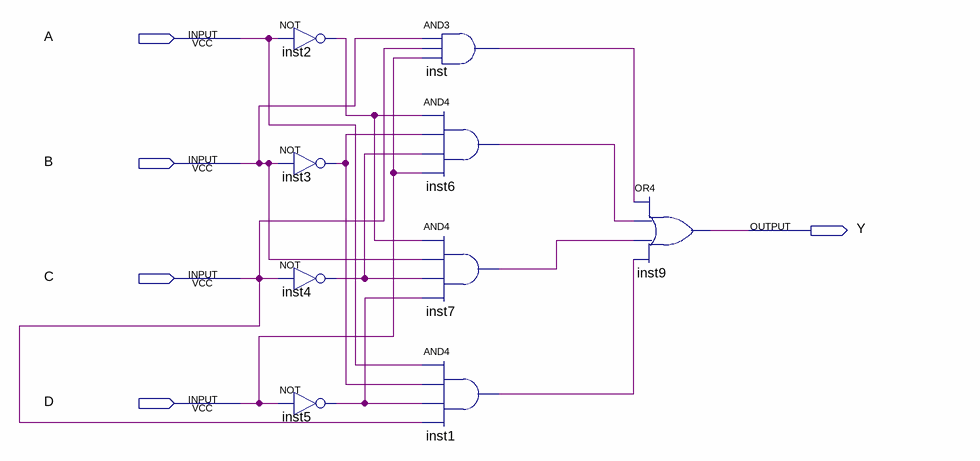
[diagram p0: schematic sheet]
// Quartus schematic circuit3.bdf as structural Verilog: 9 symbols, 5 pins
module circuit3 (
  input  A,
  input  B,
  input  C,
  input  D,
  output Y
);

  wire inst1_out, inst2_out, inst3_out, inst4_out, inst5_out, inst6_out, inst7_out, inst_out;

  not inst2 (inst2_out, A);
  not inst3 (inst3_out, B);
  not inst4 (inst4_out, C);
  not inst5 (inst5_out, D);
  and inst (inst_out, B, C, D);
  and inst6 (inst6_out, inst2_out, inst3_out, inst4_out, D);
  and inst7 (inst7_out, inst2_out, B, inst4_out, inst5_out);
  and inst1 (inst1_out, A, inst3_out, inst5_out, C);
  or inst9 (Y, inst_out, inst6_out, inst7_out, inst1_out);
endmodule
